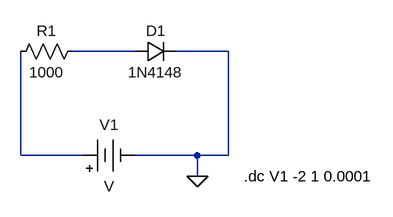
[diagram p0: schematic VI_Diode_pn_Forward.asc]
VI_Diode_pn_Forward.asc, the LTspice schematic file:
Version 4
SHEET 1 880 680
WIRE 176 112 80 112
WIRE 320 112 240 112
WIRE 0 272 0 112
WIRE 96 272 0 272
WIRE 272 272 176 272
WIRE 320 272 320 112
WIRE 320 272 272 272
WIRE 272 304 272 272
FLAG 272 304 0
SYMBOL res 96 96 R90
WINDOW 0 0 56 VBottom 2
WINDOW 3 32 56 VTop 2
SYMATTR InstName R1
SYMATTR Value 1000
SYMBOL diode 176 128 R270
WINDOW 0 32 32 VTop 2
WINDOW 3 0 32 VBottom 2
SYMATTR InstName D1
SYMATTR Value 1N4148
SYMBOL Misc\\battery 80 272 R270
WINDOW 0 32 56 VTop 2
WINDOW 3 -32 56 VBottom 2
SYMATTR InstName V1
TEXT 344 304 Left 2 !.dc V1 -2 1 0.0001

The netlist it stands for:
* VI_Diode_pn_Forward.asc
R1 N001 N002 1000
D1 N001 0 1N4148
V1 N002 0 V
.model D D
.lib standard.dio
.dc V1 -2 1 0.0001
.backanno
.end